# EAGLE design atmega16prog (EAGLE 6.1)
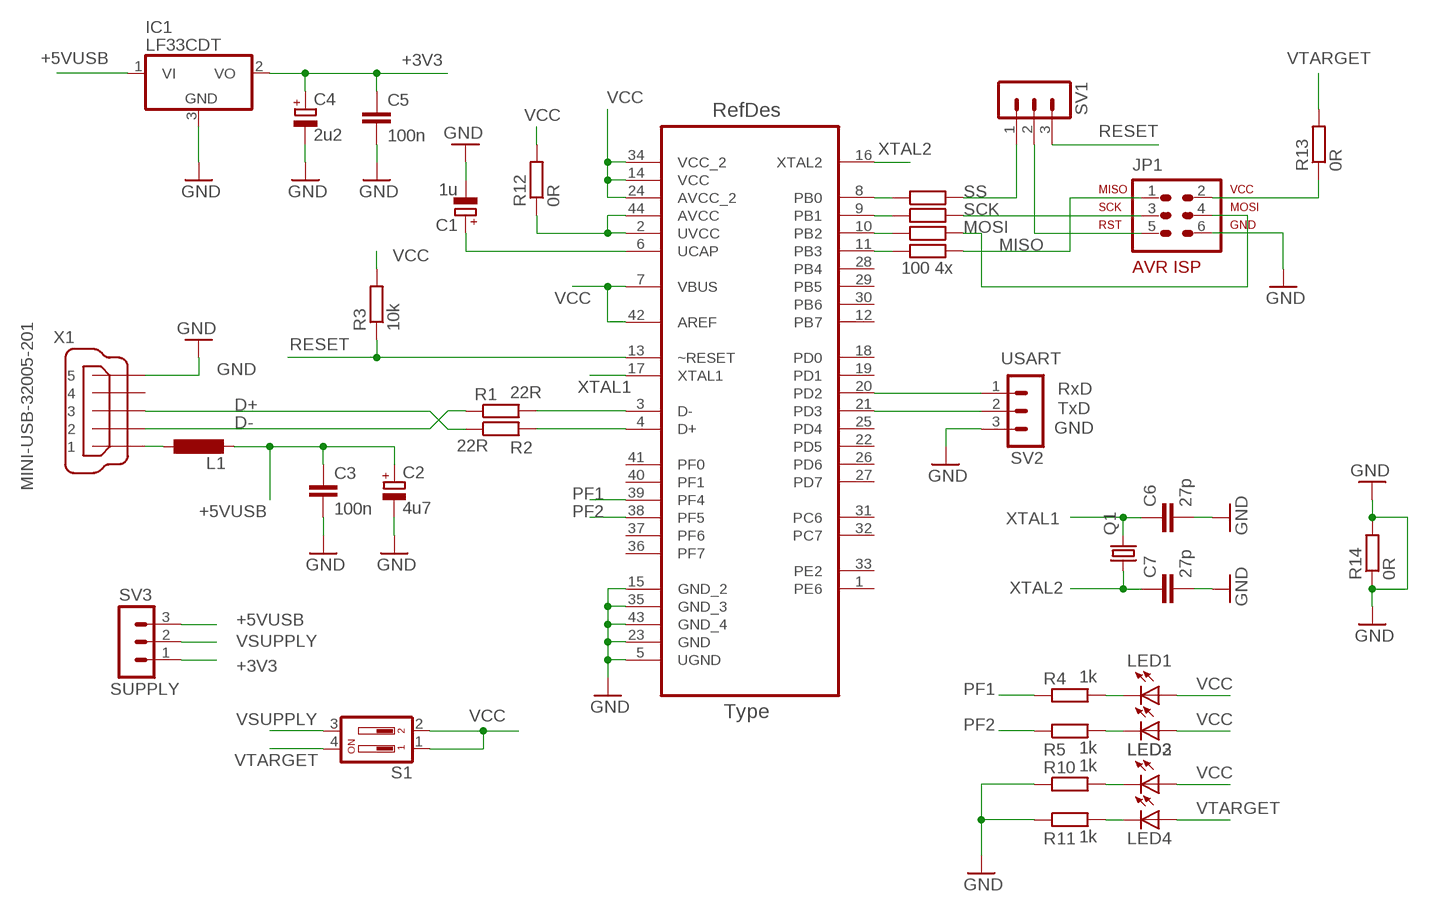
[diagram p0: schematic, sheet 1]

## Parts
C1  1u  CPOL-EUSMCA  [SMC_A]
C2  4u7  CPOL-EUSMCB  [SMC_B]
C3  100n  C-EUC0805K  [C0805K]
C4  2u2  CPOL-EUA/3216-18W  [A/3216-18W]
C5  100n  C-EUC0805K  [C0805K]
C6  27p  C-EUC0805K  [C0805K]
C7  27p  C-EUC0805K  [C0805K]
IC1  LF33CDT  7805DT  [TO252]
JP1  AVR-ISP-6VERT  [AVR-ISP-6]
L1  L-EU0204/7  [0204/7]
LED1  LED3MM  [LED3MM]
LED2  LED3MM  [LED3MM]
LED3  LED3MM  [LED3MM]
LED4  LED3MM  [LED3MM]
Q1  CRYSTALHC49S  [HC49/S]
R1  22R  R-EU_M0805  [M0805]
R2  22R  R-EU_M0805  [M0805]
R3  10k  R-EU_M0805  [M0805]
R4  1k  R-EU_M0805  [M0805]
R5  1k  R-EU_M0805  [M0805]
R6  100 4x  R-EU_M0805  [M0805]
R7  R-EU_R0805  [R0805]
R8  R-EU_M0805  [M0805]
R9  100  R-EU_M0805  [M0805]
R10  1k  R-EU_M0805  [M0805]
R11  1k  R-EU_M0805  [M0805]
R12  0R  R-EU_MELF0102W  [MINI_MELF-0102W]
R13  0R  R-EU_MELF0102W  [MINI_MELF-0102W]
R14  0R  R-EU_MELF0102W  [MINI_MELF-0102W]
S1  DS02  [DS-02]
SV1  MA03-1  [MA03-1]
SV2  MA03-1  [MA03-1]
SV3  MA03-1  [MA03-1]
U1  ATMEGA16U4-AU  [QFP80P1200X1200X120-44N]
X1  MINI-USB-32005-201  [32005-201]

## Nets
+3V3: C4.+ C5.1 IC1.2(VO) SV3.1
+5VUSB: C2.+ C3.1 IC1.1(VI) L1.2 SV3.3
D+: R2.1 X1.3
D-: R1.1 X1.2
GND: C1.- C2.- C3.2 C4.- C5.2 C6.2 C7.2 IC1.3(GND) JP1.6 R10.1 R11.1 R14.1 R14.2 SV2.3 U1.5(UGND) U1.15(GND_2) U1.23(GND) U1.35(GND_3) U1.43(GND_4) X1.5
MISO: JP1.1 R6.2
MOSI: JP1.4 R7.2
N$1: C1.+ U1.6(UCAP)
N$2: SV2.1 U1.20(PD2)
N$3: R2.2 U1.4(D+)
N$4: R1.2 U1.3(D-)
N$5: R9.1 U1.8(PB0)
N$6: R8.1 U1.9(PB1)
N$7: SV2.2 U1.21(PD3)
N$8: LED1.K(C) R4.2
N$9: LED2.K(C) R5.2
N$10: R7.1 U1.10(PB2)
N$11: R6.1 U1.11(PB3)
N$12: L1.1 X1.1
N$13: LED3.K(C) R10.2
N$14: LED4.K(C) R11.2
N$15: R12.1 U1.2(UVCC) U1.44(AVCC)
N$16: JP1.2 R13.1
PF1: R4.1 U1.39(PF4)
PF2: R5.1 U1.38(PF5)
RESET: R3.1 SV1.3 U1.13(~RESET)
RST: JP1.5 SV1.2
SCK: JP1.3 R8.2
SS: R9.2 SV1.1
VCC: LED1.A LED2.A LED3.A R3.2 R12.2 S1.1 S1.2 U1.7(VBUS) U1.14(VCC) U1.24(AVCC_2) U1.34(VCC_2) U1.42(AREF)
VSUPPLY: S1.3 SV3.2
VTARGET: LED4.A R13.2 S1.4
XTAL1: C6.1 Q1.2 U1.17(XTAL1)
XTAL2: C7.1 Q1.1 U1.16(XTAL2)
Unconnected: U1.1(PE6) U1.12(PB7) U1.18(PD0) U1.19(PD1) U1.22(PD5) U1.25(PD4) U1.26(PD6) U1.27(PD7) U1.28(PB4) U1.29(PB5) U1.30(PB6) U1.31(PC6) U1.32(PC7) U1.33(PE2) U1.36(PF7) U1.37(PF6) U1.40(PF1) U1.41(PF0) X1.4

## Notes on the sheet
- USART
- RxD
- TxD
- GND
- SUPPLY

## Library data of the parts
C1 = rcl:CPOL-EU: POLARIZED CAPACITOR, European symbol
C2 C4 = resistor:CPOL-EU: POLARIZED CAPACITOR, European symbol
C3 C5-C7 = rcl:C-EU: CAPACITOR, European symbol
IC1 = linear:78*: Positive VOLTAGE REGULATOR Source: http://cache.national.com/ds/LM/LM78L05.pdf http://www.fairchildsemi.com/ds/LM/LM7805.pdf
JP1 = avr-7:AVR-ISP-6: AVR ISP-6 Serial Programming Header
L1 = rcl:L-EU: INDUCTOR, European symbol
LED1-LED4 = led:LED: LED OSRAM: - CHIPLED LG R971, LG N971, LY N971, LG Q971, LY Q971, LO R971, LY R971 LH N974, LH R974 LS Q976, LO Q976, LY Q976 LO Q996 - Hyper CHIPLED LW Q18S LB Q993, LB Q99A, LB R99A - SideLED LS A670, LO A670, LY A670, LG A670, LP A670 LB A673, LV A673, LT A673, LW A673 LH A674 LY A675 LS A676, LA A676, LO A676, LY A676, LW A676 LS A679, LY A679, LG A679 - Hyper Micro SIDELED® LS Y876, LA Y876, LO Y876, LY Y876 LT Y87S - SmartLED LW L88C, LW L88S LB L89C, LB L89S, LG L890 LS L89K, LO L89K, LY L89K LS L896, LA L896, LO L896, LY L896 - TOPLED LS T670, LO T670, LY T670, LG T670, LP T670 LSG T670, LSP T670, LSY T670, LOP T670, LYG T670 LG T671, LOG T671, LSG T671 LB T673, LV T673, LT T673, LW T673 LH T674 LS T676, LA T676, LO T676, LY T676, LB T676, LH T676, LSB T676, LW T676 LB T67C, LV T67C, LT T67C, LS T67K, LO T67K, LY T67K, LW E67C LS E67B, LA E67B, LO E67B, LY E67B, LB E67C, LV E67C, LT E67C LW T67C LS T679, LY T679, LG T679 LS T770, LO T770, LY T770, LG T770, LP T770 LB T773, LV T773, LT T773, LW T773 LH T774 LS E675, LA E675, LY E675, LS T675 LS T776, LA T776, LO T776, LY T776, LB T776 LHGB T686 LT T68C, LB T68C - Hyper Mini TOPLED® LB M676 - Mini TOPLED Santana® LG M470 LS M47K, LO M47K, LY M47K Source: http://www.osram.convergy.de LUXEON: - LUMILED® LXK2-PW12-R00, LXK2-PW12-S00, LXK2-PW14-U00, LXK2-PW14-V00 LXK2-PM12-R00, LXK2-PM12-S00, LXK2-PM14-U00 LXK2-PE12-Q00, LXK2-PE12-R00, LXK2-PE12-S00, LXK2-PE14-T00, LXK2-PE14-U00 LXK2-PB12-K00, LXK2-PB12-L00, LXK2-PB12-M00, LXK2-PB14-N00, LXK2-PB14-P00, LXK2-PB14-Q00 LXK2-PR12-L00, LXK2-PR12-M00, LXK2-PR14-Q00, LXK2-PR14-R00 LXK2-PD12-Q00, LXK2-PD12-R00, LXK2-PD12-S00 LXK2-PH12-R00, LXK2-PH12-S00 LXK2-PL12-P00, LXK2-PL12-Q00, LXK2-PL12-R00 Source: www.luxeon.com KINGBRIGHT: KA-3528ASYC Source: www.kingbright.com
Q1 = crystal:CRYSTAL: CRYSTAL; OC_FARNELL: 1667008; OC_NEWARK: unknown
R1-R14 = resistor:R-EU_: RESISTOR, European symbol
S1 = switch-dil:DS02: DIL/CODE SWITCH; OC_FARNELL: 9472126; OC_NEWARK: unknown
SV1-SV3 = con-lstb:MA03-1: PIN HEADER
U1 = atmega16U4:ATMEGA16U4-AU; DESCRIPTION: Microcontroller with USB Controller; MPN: ATMEGA16U4-AU; OC_FARNELL: 1748521; OC_NEWARK: 26R5623; PACKAGE: TQFP-44; SUPPLIER: Atmel
X1 = con-cypressindustries:MINI-USB-: MINI USB-B Conector Source: www.cypressindustries.com

## Board
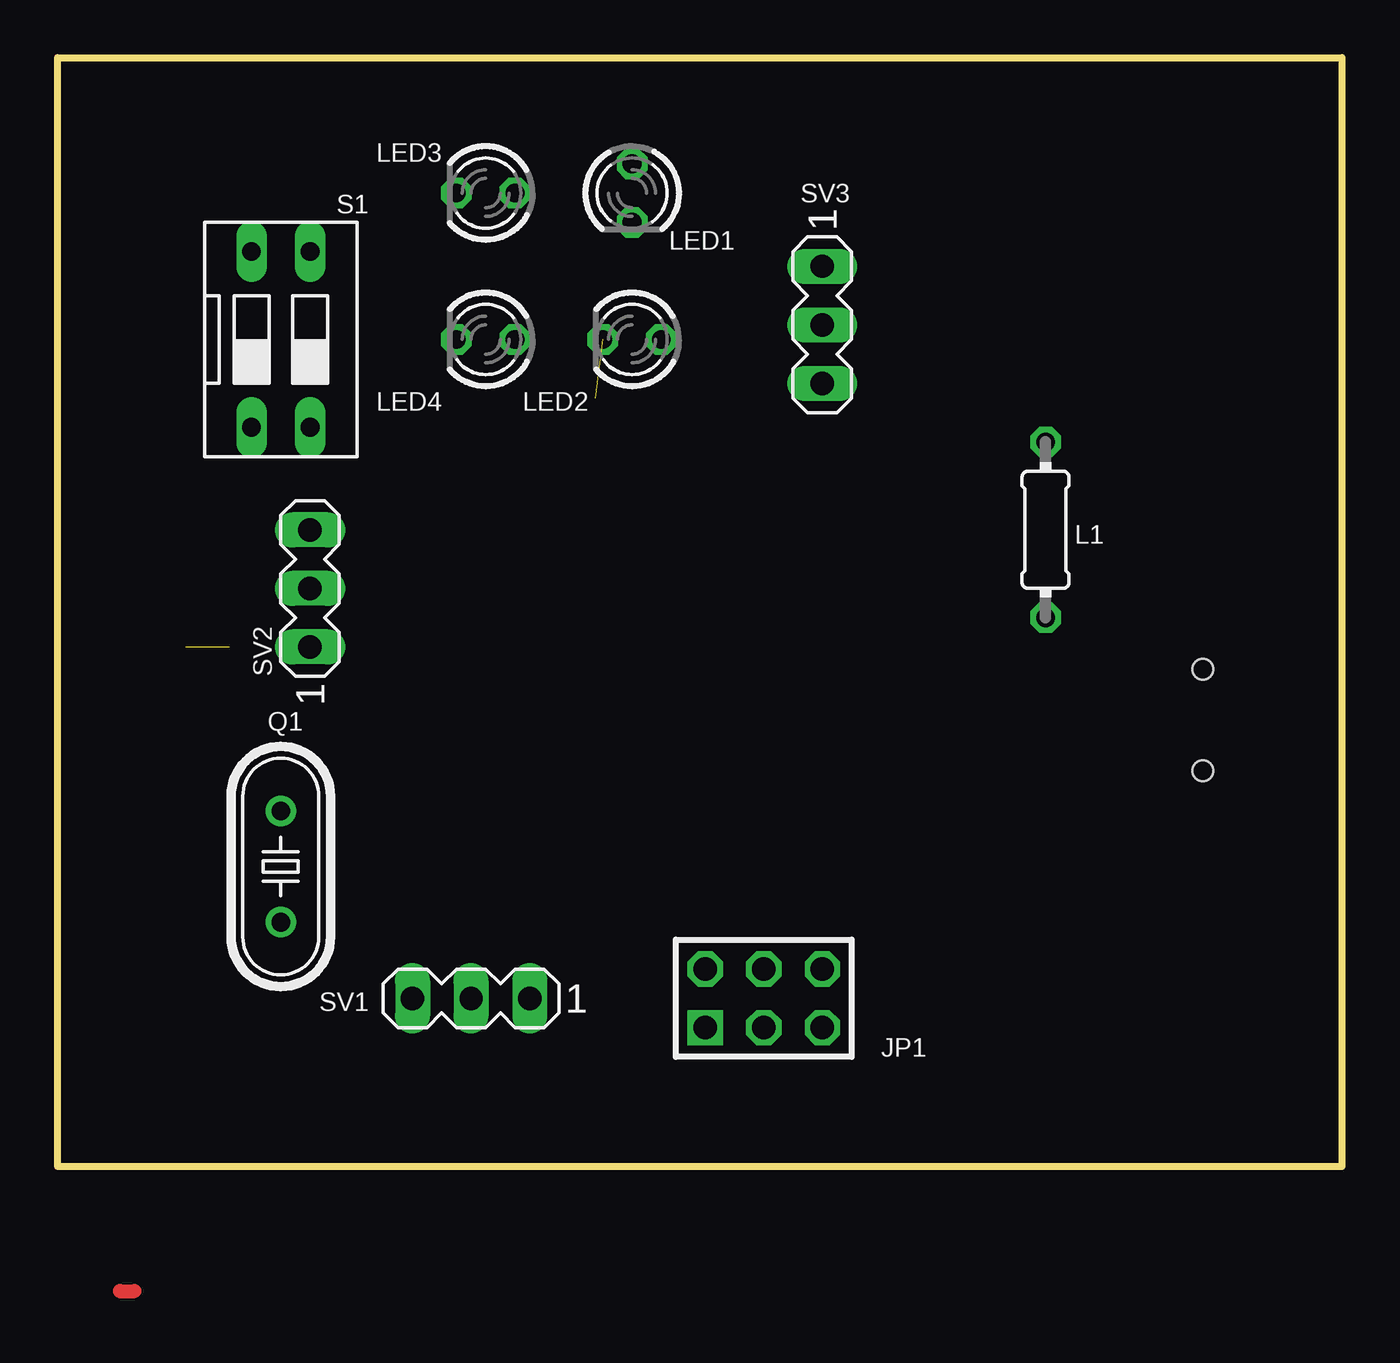
[diagram p1: board, top side]
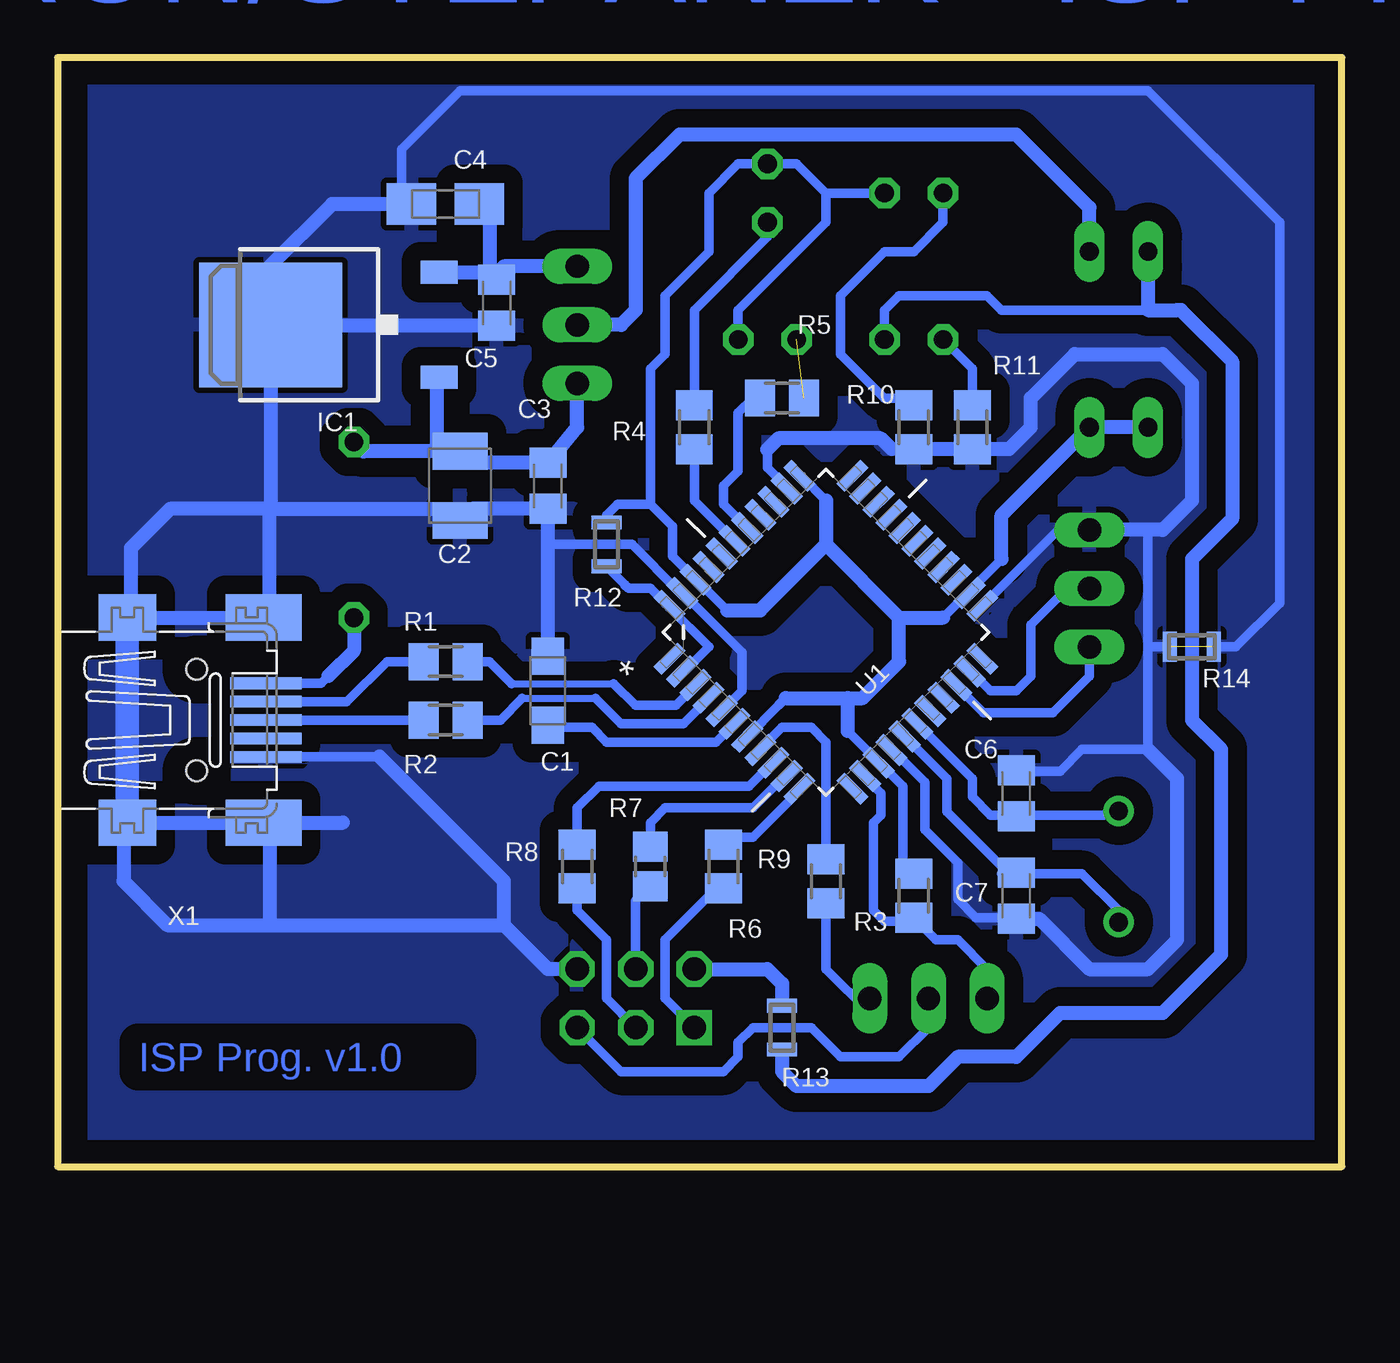
[diagram p2: board, bottom side, seen from below]

Size 55.72 x 48.1 mm. Coordinates in mm from the lower left corner, seen from the top.
Outline: 55.72,48.1 55.72,0 0,0 0,48.1 55.72,48.1
Copper layers (1*16): Top 0.035mm / dielectric 1.5mm / Bottom 0.035mm
Design rules: minimum track width 10mil, minimum drill 24mil, track to track 8mil, track to pad 8mil, pad to pad 8mil, via to via 8mil, smd to smd 8mil, copper to edge 40mil, drill to drill 8mil, minimum pad ring 10mil, minimum via ring 8mil, stop-mask expansion 4mil, vias tented up to drill 0mil, thermal gap 10mil

### Footprints (pad centres in the part's own frame; a part is rotated, then mirrored left to right if it is on the bottom)
SMC_A = smd 1.6 x 1.4: + -1.5,0; - 1.5,0
SMC_B = smd 1.6 x 2.4: + -1.5,0; - 1.5,0
C0805K = smd 1.3 x 1.6: 1 -1,0; 2 1,0
A/3216-18W = smd 2.15 x 1.8: + 1.475,0; - -1.475,0
TO252 = smd 1 x 1.6: 1 -2.28,-4.8; 2 2.28,-4.8 | smd 5.4 x 6.2: 3 0,2.5
AVR-ISP-6 = drill 1.016 square: 1 -2.54,-1.27 | drill 1.016 octagon: 2 -2.54,1.27; 3 0,-1.27; 4 0,1.27; 5 2.54,-1.27; 6 2.54,1.27
0204/7 = drill 0.813 octagon: 1 -3.81,0; 2 3.81,0
LED3MM = drill 0.813 octagon: A -1.27,0; K 1.27,0
HC49/S = drill 0.813: 1 -2.413,0; 2 2.413,0
M0805 = smd 1.3 x 1.6: 1 -0.95,0; 2 0.95,0
R0805 = smd 1.3 x 1.5: 1 -0.85,0; 2 0.85,0
MINI_MELF-0102W = smd 0.6 x 1.3: 1 -0.95,0; 2 0.95,0
DS-02 = drill 0.813 long: 1 -1.27,-3.81; 2 1.27,-3.81; 3 1.27,3.81; 4 -1.27,3.81
MA03-1 = drill 1.016 long: 1 -2.54,0; 2 0,0; 3 2.54,0
QFP80P1200X1200X120-44N = smd 1.473 x 0.508: 1 -5.613,3.988; 2 -5.613,3.2; 3 -5.613,2.388; 4 -5.613,1.6; 5 -5.613,0.787; 6 -5.613,0; 7 -5.613,-0.787; 8 -5.613,-1.6; 9 -5.613,-2.388; 10 -5.613,-3.2; 11 -5.613,-3.988; 23 5.613,-3.988; 24 5.613,-3.2; 25 5.613,-2.388; 26 5.613,-1.6; 27 5.613,-0.787; 28 5.613,0; 29 5.613,0.787; 30 5.613,1.6; 31 5.613,2.388; 32 5.613,3.2; 33 5.613,3.988 | smd 0.508 x 1.473: 12 -3.988,-5.613; 13 -3.2,-5.613; 14 -2.388,-5.613; 15 -1.6,-5.613; 16 -0.787,-5.613; 17 0,-5.613; 18 0.787,-5.613; 19 1.6,-5.613; 20 2.388,-5.613; 21 3.2,-5.613; 22 3.988,-5.613; 34 3.988,5.613; 35 3.2,5.613; 36 2.388,5.613; 37 1.6,5.613; 38 0.787,5.613; 39 0,5.613; 40 -0.787,5.613; 41 -1.6,5.613; 42 -2.388,5.613; 43 -3.2,5.613; 44 -3.988,5.613
32005-201 = smd 3.1 x 0.5: 1 3,1.6; 2 3,0.8; 3 3,0; 4 3,-0.8; 5 3,-1.6 | smd 2.5 x 2: M1 -3,-4.45; M2 -3,4.45 | smd 3.3 x 2: M3 2.9,4.45; M4 2.9,-4.45 | hole 0.9: 0,2.2; 0,-2.2

### Placement (x,y rotation side)
C1  34.45,20.64 90 bottom
C2  38.26,29.53 270 bottom
C3  34.45,29.53 270 bottom
C4  38.89,41.75 0 bottom
C5  36.67,37.46 270 bottom
C6  14.13,16.19 90 bottom
C7  14.13,11.75 270 bottom
IC1  43.97,36.51 90 bottom
JP1  30.64,7.3 0 top
L1  42.86,27.62 90 top
LED1  24.92,42.23 270 top
LED2  24.92,35.88 180 top
LED3  18.57,42.23 180 top
LED4  18.57,35.88 180 top
Q1  9.68,13.02 90 top
R1  38.89,21.91 0 bottom
R2  38.89,19.37 0 bottom
R3  18.57,11.75 90 bottom
R4  28.1,32.07 90 bottom
R5  24.29,33.34 0 bottom
R6  26.83,13.02 270 bottom
R7  30,13.02 270 bottom
R8  33.18,13.02 270 bottom
R9  22.38,12.38 270 bottom
R10  18.57,32.07 90 bottom
R11  16.03,32.07 90 bottom
R12  31.91,26.99 90 bottom
R13  24.29,6.03 270 bottom
R14  6.51,22.54 180 bottom
S1  9.68,35.88 0 top
SV1  17.94,7.3 180 top
SV2  10.95,25.08 90 top
SV3  33.18,36.51 270 top
U1  22.38,23.18 45 bottom
X1  49.69,19.37 0 bottom

### Tracks (layer width: path | path; a pad name or v marks a point on that pad's centre or on a via)
+3V3
  Bottom 0.406: 37,38.79 C5.1 36.94,38.46 36.99,38.42 | C4.+ 37.15,41.75 36.99,41.59
  Bottom 0.61: SV3.1 36.35,39.05 36.94,38.46 | IC1.2 37,38.79 | 36.99,41.59 36.99,38.42
+5VUSB
  Bottom 0.406: 37.99,30.53 38.26,30.8 C2.+ 38.49,30.8 38.89,30.8 39.27,31.17 | IC1.1 39.27,34.23
  Bottom 0.61: C2.+ 42.46,31.03 L1.2 | SV3.3 33.18,32.07 C3.1 37.99,30.53 | 39.27,34.23 39.27,31.17
D+
  Bottom 0.406: X1.3 R2.1
D-
  Bottom 0.406: X1.2 44.44,20.17 43.18,20.16 41.43,21.91 R1.1
GND  (1 unrouted)
  Bottom 0.406: SV2.3 12.3,27.62 U1.23 | C6.2 14.08,17.14 12.22,17.14 11.27,18.1 8.41,18.1 8.41,22.54 | 34.18,28.89 C3.2 34.45,28.26 | U1.15 19.51,18.08 18.1,16.67 18.1,14.6 16.67,13.18 16.67,11.59 15.87,10.8 14.45,10.8 | 14.45,10.8 14.13,11.11 | U1.35 24.09,29.49 24.92,30.32 24.92,31.12 | U1.5 26.03,20.64 26.03,22.3 U1.43 28.62,24.96 28.77,24.96 30.8,26.99 34.29,26.99 34.45,26.83 | 38.53,28.53 38.26,28.26 C2.- 37.76,28.53 | R10.1 19.53,31.12 | 46.83,17.78 46.51,17.78 | 46.51,17.78 41.75,17.78 | C7.2 14.4,10.75 14.45,10.8 | X1.5 46.53,17.77 46.51,17.78 | 46.47,28.93 46.51,28.89 46.51,28.53 | 46.51,39.05 46.51,36.55 IC1.3 46.43,36.46 | 40.16,41.59 40.8,42.23 40.8,44.13 38.26,46.67 8.41,46.67 2.7,40.96 2.7,24.45 4.6,22.54 R14.1 | R14.2 8.41,22.54 | 8.41,22.54 8.41,27.62
  Bottom 0.61: 49.05,35.88 IC1.3 46.47,28.93 | C1.- 34.45,26.83 34.45,28.26 | 46.51,28.53 38.53,28.53 | C3.2 37.76,28.53 | 19.53,31.12 20,31.59 24.45,31.59 24.92,31.12 | R10.1 R11.1 14.44,31.12 13.49,32.07 13.49,33.34 11.59,35.24 7.78,35.24 6.51,33.97 6.51,28.89 7.78,27.62 8.41,27.62 SV2.3 | C7.2 13.13,10.75 10.95,8.57 8.41,8.57 7.14,9.84 7.14,16.83 8.41,18.1 | JP1.6 34.45,8.57 36.35,10.48 | 36.35,10.48 36.35,12.38 41.75,17.78 | C4.- 43.81,41.75 46.51,39.05 | C5.2 46.43,36.46 | 46.51,28.53 46.51,23.81 52.23,23.81 | 52.86,23.81 52.23,23.81 | 47.15,14.92 46.51,14.92 46.51,10.48 | 46.51,28.53 50.85,28.53 52.55,26.83 52.55,24.13 52.23,23.81 | 52.55,23.81 52.7,23.65 | 46.51,10.48 50.96,10.48 52.86,12.38 52.86,14.92 | 46.51,10.48 36.35,10.48 | 52.7,15.08 52.86,14.92 | 52.86,14.92 43.34,14.92
  Bottom 1.016: 52.7,23.65 52.7,15.08
  pour Bottom (isolate 0.813): 0.79,47.31 54.13,47.31 54.13,0.95 0.79,0.95
MISO
  Bottom 0.406: JP1.1 29.37,7.3 29.37,9.84 26.83,12.38 R6.2
MOSI
  Bottom 0.406: JP1.4 30.64,11.53 R7.2
N$1
  Bottom 0.406: U1.6 27.15,18.42 31.91,18.42 32.54,19.05 34.13,19.05 34.45,19.37
  Bottom 0.61: C1.+ 34.45,19.37
N$2
  Bottom 0.406: U1.20 16.73,20.85 15.56,19.69 12.54,19.69 10.95,21.27 SV2.1
N$3
  Bottom 0.305: 35.56,20.32 32.38,20.32
  Bottom 0.406: U1.4 27.48,20.3 28.57,19.21 31.27,19.21 32.38,20.32 | R2.2 36.51,19.37 35.56,20.32
N$4
  Bottom 0.305: 36.04,20.96 31.59,20.96
  Bottom 0.406: U1.3 28.04,20.85 28.89,20 30.64,20 31.59,20.96 | R1.2 36.99,21.91 36.04,20.96
N$5
  Bottom 0.406: U1.8 25.22,18.12 24.29,19.05 23.02,19.05 22.38,18.42 R9.1 22.38,13.02
N$6
  Bottom 0.406: U1.9 24.71,17.52 25.72,16.51 32.23,16.51 33.18,15.56 R8.1 33.18,13.65
N$7
  Bottom 0.406: U1.21 16.07,21.47 15.24,20.64 14.13,20.64 13.49,21.27 13.49,23.49 11.91,25.08 SV2.2
N$8
  Bottom 0.406: LED1.K 24.92,40.32 28.1,37.15 R4.2 28.1,32.7
N$9  (1 unrouted)
N$10
  Bottom 0.406: U1.10 24.17,16.95 25.56,15.56 29.37,15.56 30,14.92 R7.1
N$11
  Bottom 0.406: U1.11 23.53,16.31 25.56,14.29 26.51,14.29 R6.1
N$12
  Bottom 0.406: X1.1 44.28,20.97 43.97,21.27
  Bottom 0.61: L1.1 42.86,22.38 43.97,21.27
N$13
  Bottom 0.406: LED3.K 17.3,40.96 18.57,39.69 19.84,39.69 21.75,37.78 21.75,35.24 19.84,33.34 18.89,33.34 R10.2
N$14
  Bottom 0.406: 16.03,32.7 R11.2 16.03,34.61 LED4.K
N$15
  Bottom 0.406: 29.17,24.25 U1.44 29.25,24.33 29.37,24.45 | 28.53,21.47 U1.2 28.62,21.55 28.46,21.55 27.46,22.54 29.21,24.29 29.21,24.45 29.37,24.45 | R12.1 31.11,25.24 30.96,25.08 30,25.08 29.37,24.45
N$16
  Bottom 0.61: JP1.2 24.92,8.57 24.29,7.94 R13.1
N$17
  Top 0.61: 2.7,-5.4 3.33,-5.4
PF1
  Bottom 0.406: U1.39 28.1,28.89 R4.1
PF2
  Bottom 0.406: U1.38 26.83,28.73 26.83,29.53 26.19,30.16 26.19,32.7 25.56,33.34 R5.1
RESET
  Bottom 0.406: U1.13 20.68,16.87 20,16.19 20,15.24 20.32,14.92 20.32,11.11 19.84,10.64 18.73,10.64 R3.1 17.62,9.84 16.67,9.84 15.4,8.57 SV1.3
RST
  Bottom 0.406: JP1.5 31.27,4.13 26.83,4.13 26.19,4.76 26.19,5.4 25.56,6.03 23.02,6.03 21.75,4.76 19.21,4.76 17.94,6.03 SV1.2
SCK
  Bottom 0.406: R8.2 33.18,11.11 31.91,9.84 31.91,7.3 JP1.3
SS
  Bottom 0.406: SV1.1 20.48,6.67 22.38,8.57 R9.2
VCC
  Bottom 0.406: U1.34 23.46,29.97 22.38,28.89 | 17.3,23.81 16.23,24.88 U1.24 16.15,24.96 14.76,26.35 | U1.7 24.44,20 24.13,20.32 | 30,28.73 30,34.61 29.37,35.24 29.37,37.78 27.46,39.69 27.46,42.23 26.19,43.5 LED1.A 23.65,43.5 22.38,42.23 | 30,28.73 29.05,27.78 29.05,26.47 U1.42 28,25.46 26.67,24.13 | 30,28.73 31.43,28.73 31.91,28.26 R12.2 | 18.89,12.7 19.05,12.86 19.05,16.51 20.06,17.52 U1.14 20.1,17.56 21.43,18.89 | 18.89,12.7 18.57,12.38 | R3.2 18.89,12.7 | LED3.A 22.38,42.23 | LED2.A 26.19,37.15 22.38,40.96 22.38,42.23
  Bottom 0.61: 26.67,24.13 25.24,24.13 22.38,26.99 | S1.1 S1.2 14.76,28.26 14.76,26.35 | 21.43,18.89 21.43,20.32 | 22.38,28.89 22.38,26.99 | 22.38,26.99 19.21,23.81 | 19.21,23.81 17.3,23.81 | 24.13,20.32 21.43,20.32 | 21.43,20.32 20.8,20.32 19.21,21.91 19.21,23.81
VSUPPLY
  Bottom 0.61: SV3.2 31.27,36.51 30.64,37.15 30.64,42.86 28.73,44.77 16.03,44.77 15.4,44.77 14.13,44.77 10.95,41.59 S1.3
VTARGET
  Bottom 0.406: 6.98,37.15 7.14,37.15 | 8.41,37.15 14.76,37.15 15.4,37.78 19.21,37.78 19.84,37.15 LED4.A
  Bottom 0.61: R13.2 24.29,4.13 23.65,3.49 17.94,3.49 16.67,4.76 14.13,4.76 12.22,6.67 7.78,6.67 5.24,9.21 5.24,18.1 6.51,19.37 6.51,26.35 4.76,28.1 4.76,34.92 6.98,37.15 | 7.14,37.15 8.41,37.15 S1.4
XTAL1
  Bottom 0.406: U1.17 16.03,16.83 16.03,16.03 15.24,15.24 14.08,15.24 | 14.4,14.92 C6.1 14.08,15.24 | Q1.2 10.13,15.43 10.32,15.24 13.81,15.24 | 13.81,15.24 14.08,15.24 | 13.81,15.24 14.13,14.92
XTAL2
  Bottom 0.406: U1.16 17.14,16.83 17.14,15.4 14.45,12.7 | 14.76,12.7 14.45,12.7 | 14.45,12.7 14.18,12.7 C7.1 14.08,12.7 11.27,12.7 9.68,11.11 Q1.1

### Text on the board
Bottom: MADRON/STEPANEK - ISP Prog. | ISP Prog. v1.0